# EAGLE design midi-bit-box-v1 (EAGLE 9.6.2)
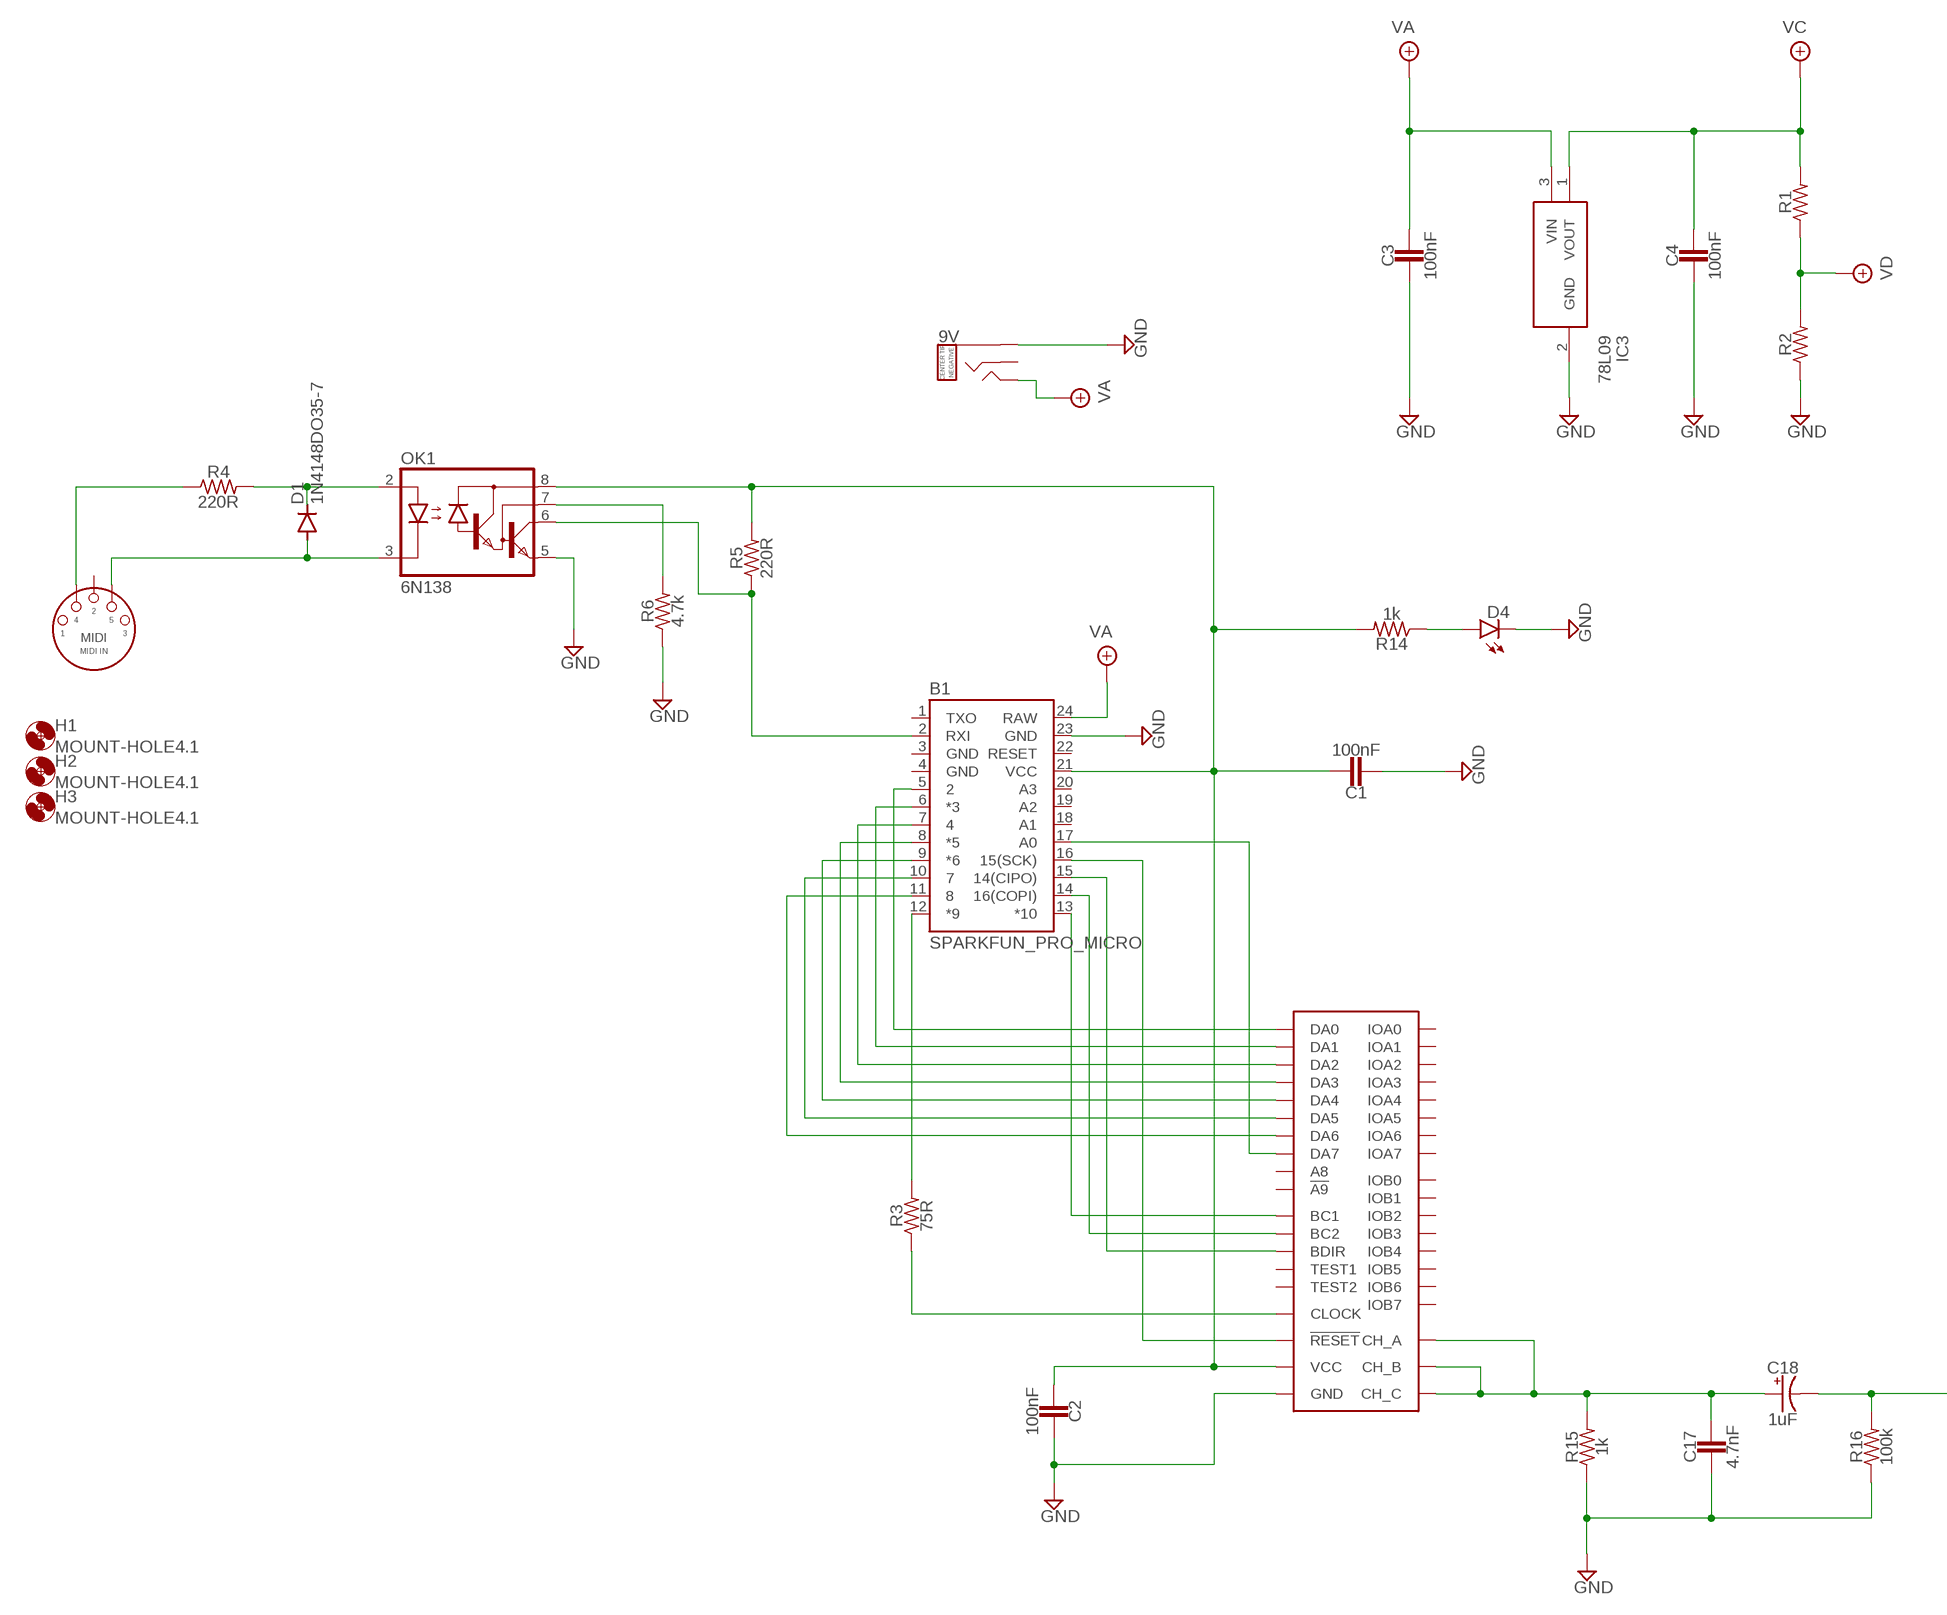
[diagram p0: schematic, sheet 1, part 1 of 2]
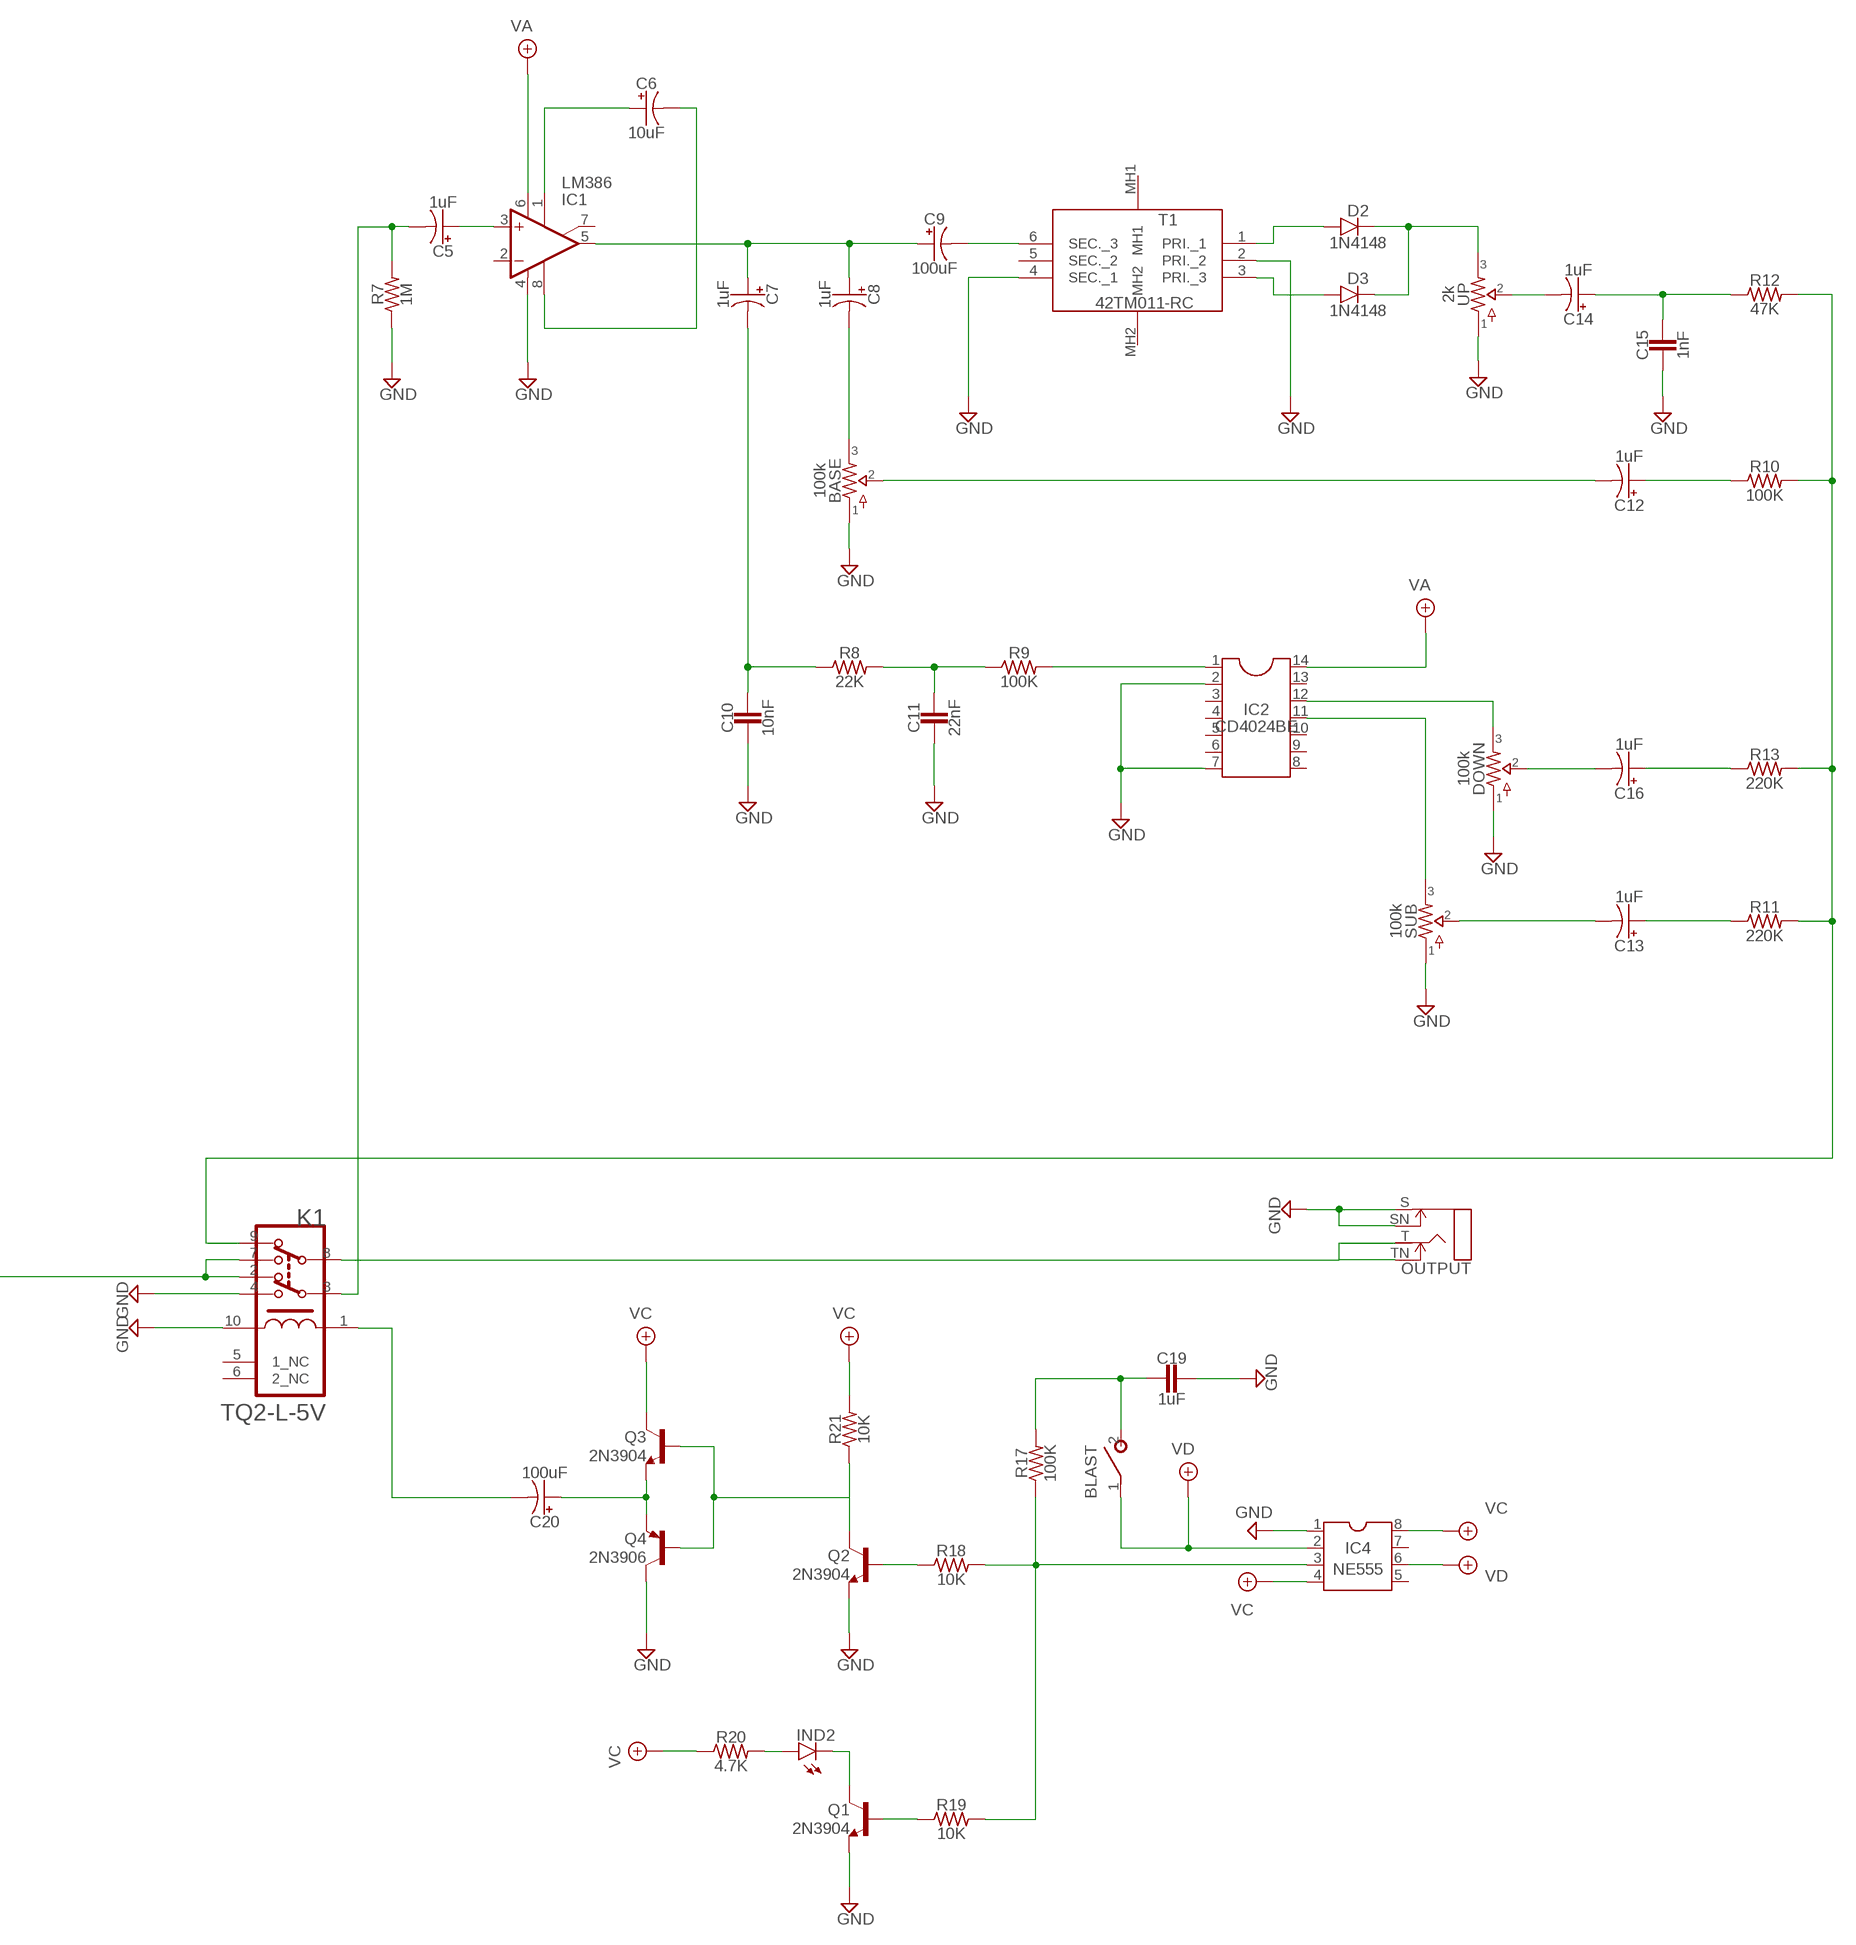
[diagram p1: schematic, sheet 1, part 2 of 2]

## Parts
9V  DC_TRS_PADS  [DC_TRS]
B1  SPARKFUN_PRO_MICRO  [SPARKFUN_PRO_MICRO]
BASE  100k  TRIMMER  [TRIM1]
BLAST  SPST  [SPST.WIRE]
C1  100nF  CAP.2  [0.2".SML]
C2  100nF  CAP.2  [0.2".SML]
C3  100nF  CAP.2  [0.2".SML]
C4  100nF  CAP.2  [0.2".SML]
C5  1uF  5MM.2  [0502]
C6  10uF  5MM.2  [0502]
C7  1uF  5MM.2  [0502]
C8  1uF  5MM.2  [0502]
C9  100uF  5MM.2  [0502]
C10  10nF  CAP.2  [0.2".SML]
C11  22nF  CAP.2  [0.2".SML]
C12  1uF  5MM.2  [0502]
C13  1uF  5MM.2  [0502]
C14  1uF  5MM.2  [0502]
C15  1nF  CAP.2  [0.2".SML]
C16  1uF  5MM.2  [0502]
C17  4.7nF  CAP.2  [0.2".SML]
C18  1uF  5MM.2  [0502]
C19  1uF  CAP.4  [0.2".LRG]
C20  100uF  5MM.2  [0502]
D1  1N4148DO35-7  [DO35-7]
D2  1N4148  DO41.3  [DO41-3]
D3  1N4148  DO41.3  [DO41-3]
D4  LED.2  [3MM_1]
DOWN  100k  TRIMMER  [TRIM1]
H1  MOUNT-HOLE4.1  [4,1]
H2  MOUNT-HOLE4.1  [4,1]
H3  MOUNT-HOLE4.1  [4,1]
IC1  LM386  [DIP08]
IC2  CD4024BE  DIP14  [DIP14.1]
IC3  78L09  L78L09ACZ-TR  [L78L09ACZTR]
IC4  NE555  DIP8_TH  [DIP08]
IND2  5MM_LED  LED.2  [3MM_1]
K1  PANASONIC_TQ2-L-5VPANASONIC_TQ2-L-5V_0_0  [PANASONIC_TQ2-L-5V_0]
MIDI  MIDI IN  MIDI  [3PADS]
OK1  6N138  [DIL08]
OUTPUT  SWITCHED_MONO_PADS  [4PADS]
Q1  2N3904  2N5088  [TO92]
Q2  2N3904  2N5088  [TO92]
Q3  2N3904  2N5088  [TO92]
Q4  2N3906  2N5087  [TO92]
R1  R.3B  [0.3".B]
R2  R.3B  [0.3".B]
R3  75R  R.3B  [0.3".B]
R4  220R  R.3B  [0.3".B]
R5  220R  R.3B  [0.3".B]
R6  4.7k  R.3B  [0.3".B]
R7  1M  R.3B  [0.3".B]
R8  22K  R.3B  [0.3".B]
R9  100K  R.3B  [0.3".B]
R10  100K  R.3B  [0.3".B]
R11  220K  R.3B  [0.3".B]
R12  47K  R.3B  [0.3".B]
R13  220K  R.3B  [0.3".B]
R14  1k  R.3B  [0.3".B]
R15  1k  R.3B  [0.3".B]
R16  100k  R.3B  [0.3".B]
R17  100K  R.3B  [0.3".B]
R18  10K  R.3B  [0.3".B]
R19  10K  R.3B  [0.3".B]
R20  4.7K  R.3B  [0.3".B]
R21  10K  R.3B  [0.3".B]
SUB  100k  TRIMMER  [TRIM1]
T1  42TM011-RC  [42TM011RC]
U1  AY-3-8910  [DIP-40/600MIL]
UP  2k  TRIMMER  [TRIM1]

## Nets
GND: 9V.PWR B1.23(GND) BASE.1 C1.2 C2.1 C3.2 C4.2 C10.2 C11.2 C15.2 C17.2 C19.1 D4.K(C) DOWN.1 IC1.4(V-) IC2.2 IC2.7 IC3.2(GND) IC4.1 K1.4 K1.10(S-/R+) OK1.5(GND) OUTPUT.S OUTPUT.SN Q1.3(E) Q2.3(E) Q4.1(C) R2.1 R6.1 R7.1 R15.1 R16.1 SUB.1 T1.2(PRI._2) T1.4(SEC._1) U1.1(GND) UP.1
N$1: MIDI.T R4.1
N$2: D1.C OK1.2(A) R4.2
N$3: D1.A MIDI.S OK1.3(C)
N$4: B1.21(VCC) C1.1 C2.2 OK1.8(VCC) R5.2 R14.2 U1.40(VCC)
N$5: OK1.7(VB) R6.2
N$6: B1.2(RXI) OK1.6(VO) R5.1
N$7: IC4.3 R17.1 R18.2 R19.2
N$8: K1.8 OUTPUT.T OUTPUT.TN
N$9: B1.12(*9) R3.2
N$10: R3.1 U1.22(CLOCK)
N$11: B1.16(15(SCK)) U1.23(!RESET)
N$12: B1.5 U1.37(DA0)
N$13: B1.6(*3) U1.36(DA1)
N$14: B1.7 U1.35(DA2)
N$15: B1.8(*5) U1.34(DA3)
N$16: B1.9(*6) U1.33(DA4)
N$17: B1.10 U1.32(DA5)
N$18: B1.11 U1.31(DA6)
N$19: B1.17(A0) U1.30(DA7)
N$20: B1.13(*10) U1.29(BC1)
N$21: B1.14(16(COPI)) U1.28(BC2)
N$22: B1.15(14(CIPO)) U1.27(BDIR)
N$23: BASE.2 C12.-
N$24: C16.- DOWN.2
N$25: DOWN.3 IC2.12
N$26: C5.+ IC1.3(+IN)
N$27: C6.+ IC1.1(GAIN1)
N$28: C6.- IC1.8(GAIN2)
N$29: C7.+ C8.+ C9.+ IC1.5(OUT)
N$30: C9.- T1.6(SEC._3)
N$31: D2.A T1.1(PRI._1)
N$32: D3.A T1.3(PRI._3)
N$33: BASE.3 C8.-
N$34: C7.- C10.1 R8.1
N$35: C11.1 R8.2 R9.1
N$36: IC2.11 SUB.3
N$37: C13.- SUB.2
N$38: D4.A R14.1
N$39: C14.- UP.2
N$40: BLAST.2 C19.2 R17.2
N$41: C12.+ R10.1
N$42: C16.+ R13.1
N$43: C13.+ R11.1
N$44: D2.C D3.C UP.3
N$45: C5.- K1.3 R7.2
N$46: C14.+ C15.1 R12.1
N$47: C17.1 C18.+ R15.2 U1.3(CH_B) U1.4(CH_A) U1.38(CH_C)
N$48: IC2.1 R9.2
N$50: IND2.A R20.2
N$51: Q2.1(C) R21.1
N$52: Q2.2(B) R18.1
N$53: Q1.2(B) R19.1
N$54: IND2.K(C) Q1.1(C)
N$55: C20.+ Q3.3(E) Q4.3(E)
N$56: Q3.2(B) Q4.2(B)
N$57: C20.- K1.1(S+/R-)
N$58: C18.- K1.2 K1.7 R16.2
N$59: K1.9 R10.2 R11.2 R12.2 R13.2
VA: 9V.GND B1.24(RAW) C3.1 IC1.6(V+) IC2.14 IC3.3(VIN)
VC: C4.1 IC3.1(VOUT) IC4.4 IC4.8 Q3.1(C) R1.2 R20.1 R21.2
VD: BLAST.1 IC4.2 IC4.6 R1.1 R2.2
Unconnected: 9V.RNG B1.1(TXO) B1.18(A1) B1.19(A2) B1.20(A3) B1.22(RESET) IC1.2(-IN) IC1.7(BYPASS) IC2.3 IC2.4 IC2.5 IC2.6 IC2.8 IC2.9 IC2.10 IC2.13 IC4.5 IC4.7 K1.5(1_NC) K1.6(2_NC) MIDI.R T1.5(SEC._2) T1.MH1 T1.MH2 U1.6(IOB7) U1.7(IOB6) U1.8(IOB5) U1.9(IOB4) U1.10(IOB3) U1.11(IOB2) U1.12(IOB1) U1.13(IOB0) U1.14(IOA7) U1.15(IOA6) U1.16(IOA5) U1.17(IOA4) U1.18(IOA3) U1.19(IOA2) U1.20(IOA1) U1.21(IOA0) U1.24(!A9) U1.25(A8) U1.26(TEST2) U1.39(TEST1)

## Power pins joined to a net without a drawn wire
GND: B1.3(GND) B1.4(GND)

## Library data of the parts
9V = jacks:DC_TRS: Kobiconn Jack and TRS connections for DC power For center-tip negtaive connections (power from sleeve, ground from tip). Kobiconn 163-7620E: http://smallbear-electronics.mybigcommerce.com/plastic-2-1-mm-pc-mount/ Boss Style: http://smallbear-electronics.mybigcommerce.com/2-1-mm-all-plastic-round/
B1 = SparkFun-Boards:SPARKFUN_PRO_MICRO: SparkFun Pro Micro Atmega32U4 compatible footprint. SparkFun Products: 3.3V/8MHz <https://www.sparkfun.com/products/12587> 5V/16MHz <https://www.sparkfun.com/products/12640>
BASE DOWN SUB UP = potentiometers:TRIMMER: Trimpots
BLAST = switches:SPST: SPST Switches
C1-C4 C10 C11 C15 C17 C19 = caps-film:CAP: For Ceramic, Film, MLCC caps
C5-C9 C12-C14 C16 C18 C20 = caps-elec:5MM: 5mm diameter caps Up to 47uF
D1 = diode:1N4148: DIODE high speed (Philips)
D2 D3 = diodes:DO41: 1N400x, 1N5817 Standard and Schottky Rectifiers, DO-41 Package 1N4001: http://smallbear-electronics.mybigcommerce.com/diode-1n4001/ 1N5817: http://www.mouser.com/ProductDetail/Fairchild-Semiconductor/1N5817/?qs=sGAEpiMZZMtQ8nqTKtFS%2fCJFZUIIOyzjWJhH2RQmKoY%3d
D4 IND2 = diodes:LED: LEDs, all sizes 3mm: http://smallbear-electronics.mybigcommerce.com/led-t-1-3mm-diffused-colors/ 5mm: http://smallbear-electronics.mybigcommerce.com/led-t-1-3-4-5mm-diffused/
H1-H3 = holes:MOUNT-HOLE: MOUNTING HOLE with drill center marker
IC1 = integrated circuits:LM386: LM386 LM386: http://smallbear-electronics.mybigcommerce.com/ic-lm386-n3/
IC2 = integrated circuits:DIP14: Generic 14-pin DIP
IC3 = SamacSys_Parts:L78L09ACZ-TR: Standard Regulator Pos 9V 0.1A 3-Pin TO-92 T/R Source: Datasheet <https://www.st.com/resource/en/datasheet/l78l.pdf>; ARROW_PART_NUMBER: L78L09ACZ-TR; ARROW_PRICE-STOCK: https://www.arrow.com/en/products/l78l09acz-tr/stmicroelectronics; DESCRIPTION: Standard Regulator Pos 9V 0.1A 3-Pin TO-92 T/R; HEIGHT: 4.95mm; MANUFACTURER_NAME: STMicroelectronics; MANUFACTURER_PART_NUMBER: L78L09ACZ-TR; MOUSER_PART_NUMBER: 511-L78L09ACZ-TR; MOUSER_PRICE-STOCK: https://www.mouser.co.uk/ProductDetail/STMicroelectronics/L78L09ACZ-TR?qs=22WmWNTp1rrZjfk%2FYtv2vw%3D%3D
IC4 = integrated circuits:DIP8: Generic 8-pin DIP
K1 = Panasonic - TQ2-L-5V:PANASONIC_TQ2-L-5V: Telecom Relay DPDT (2 Form C) Through Hole 1A 5VDC; AMBIENT_TEMPERATURE_RANGE_HIGH: +70°C; AMBIENT_TEMPERATURE_RANGE_LOW: -40°C; AUTOMOTIVE: No; CENTROID_NOT_SPECIFIED: No; COIL_CURRENT: 20mA; COIL_POWER: 100mW; COIL_RESISTANCE: 250Ω; COIL_TYPE: Latching and Single Coil; COIL_VOLTAGE: 5V; CURRENT_RATING: 1A; DATASHEET: https://b2b-api.panasonic.eu/file_stream/pids/fileversion/4514; DEVICE_CLASS_L1: Electromechanical; DEVICE_CLASS_L2: Relays; DEVICE_CLASS_L3: Signal Relays; DIGIKEY_DESCRIPTION: RELAY TELECOM DPDT 1A 5VDC; DIGIKEY_PART_NUMBER: 255-1004-5-ND; FOOTPRINT_VARIANT_NAME_0: Recommended_Land_Pattern; HEIGHT: 5.4mm; LEAD_FREE: Yes; MF: Panasonic; MFG_PACKAGE_IDENT: 0; MFG_PACKAGE_IDENT_DATE: 0; MFG_PACKAGE_IDENT_REV: 0; MOUSER_DESCRIPTION: Electromechanical Relay 5VDC 250Ohm 1A DPDT (14x9x5)mm THT General Purpose Relay; MOUSER_PART_NUMBER: 769-TQ2-L-5V; MPN: TQ2-L-5V; NUMBER_OF_CONTACTS: 2; PACKAGE: PTH_RELAY_14MM0_9MM0; PREFIX: K; ROHS: Yes; STANDOFF_HEIGHT: 0.25mm; SWITCHING_CURRENT: 1A; SWITCHING_POWER: 30W; TEMPERATURE_RANGE_HIGH: +70°C; TEMPERATURE_RANGE_LOW: -40°C; THROW_CONFIGURATION: DPDT; VERIFICATION_VERSION: 0.0.0.3
MIDI = jacks:MIDI: MIDI Jack Switchcraft 57GB5FX: http://www.mouser.com/ProductDetail/Switchcraft/57GB5FX/?qs=%2fha2pyFadujUo7YG3MjMPfNHnb16z0gNDFv5bGzw1d%252b9onPnvFrm7g%3d%3d
OK1 = optocoupler:6N138: MOTOROLA OPTO COUPLER; MF: VISHAY/TELEFUNKEN; MPN: 6N138; OC_FARNELL: 9860150; OC_NEWARK: 35K5294
OUTPUT = jacks:SWITCHED_MONO: Mono TS Jack and wiring connections for switched applications 1/4" Marshall style (PCB Mount): http://smallbear-electronics.mybigcommerce.com/1-4-enclosed-nmj4hcd2/ 1/8" Jack (wired): http://smallbear-electronics.mybigcommerce.com/1-8-mono-pc-mount/
Q1-Q3 = transistors-BJT:2N5088: NPN - 2n5088, 2n5089, 2n3904, MPSA18 [C]-B-E pinout 2n5088: http://smallbear-electronics.mybigcommerce.com/transistor-2n5088/ 2n5089: http://smallbear-electronics.mybigcommerce.com/transistor-2n5089/ 2n5089: http://smallbear-electronics.mybigcommerce.com/transistor-2n5089-motorola/ 2n3904: http://smallbear-electronics.mybigcommerce.com/transistor-2n3904/ MPSA18: http://smallbear-electronics.mybigcommerce.com/transistor-mpsa18/
Q4 = transistors-BJT:2N5087: PNP - 2n5087, 2n3906 [C]-B-E pinout 2n5087: http://smallbear-electronics.mybigcommerce.com/transistor-2n5087/ 2n3906: http://smallbear-electronics.mybigcommerce.com/transistor-2n3906/
R1-R21 = resistors:R: 1/8W, 1/4W and 1W resistors
T1 = SamacSys_Parts:42TM011-RC: Audio Transformers / Signal Transformers XFMR ST 1.5KCT-500CT Source: Datasheet <https://www.mouser.co.uk/datasheet/2/449/XC-600134-1212477.pdf>; DESCRIPTION: Audio Transformers / Signal Transformers XFMR ST 1.5KCT-500CT; HEIGHT: 16.9926mm; MANUFACTURER_NAME: Xicon; MANUFACTURER_PART_NUMBER: 42TM011-RC; MOUSER_PART_NUMBER: 42TM011-RC; MOUSER_PRICE-STOCK: https://www.mouser.co.uk/ProductDetail/Xicon/42TM011-RC?qs=h3Xc2LqAealMFTkJCAd4Kw%3D%3D
U1 = AY-3-8910:AY-3-8910: Check prices <https://pricing.snapeda.com/parts/AY-3-8910/General%20Instrument/view-part?ref=eda>; AVAILABILITY: Not in stock; MF: General Instrument; MP: AY-3-8910; PACKAGE: None; PRICE: None

## Board
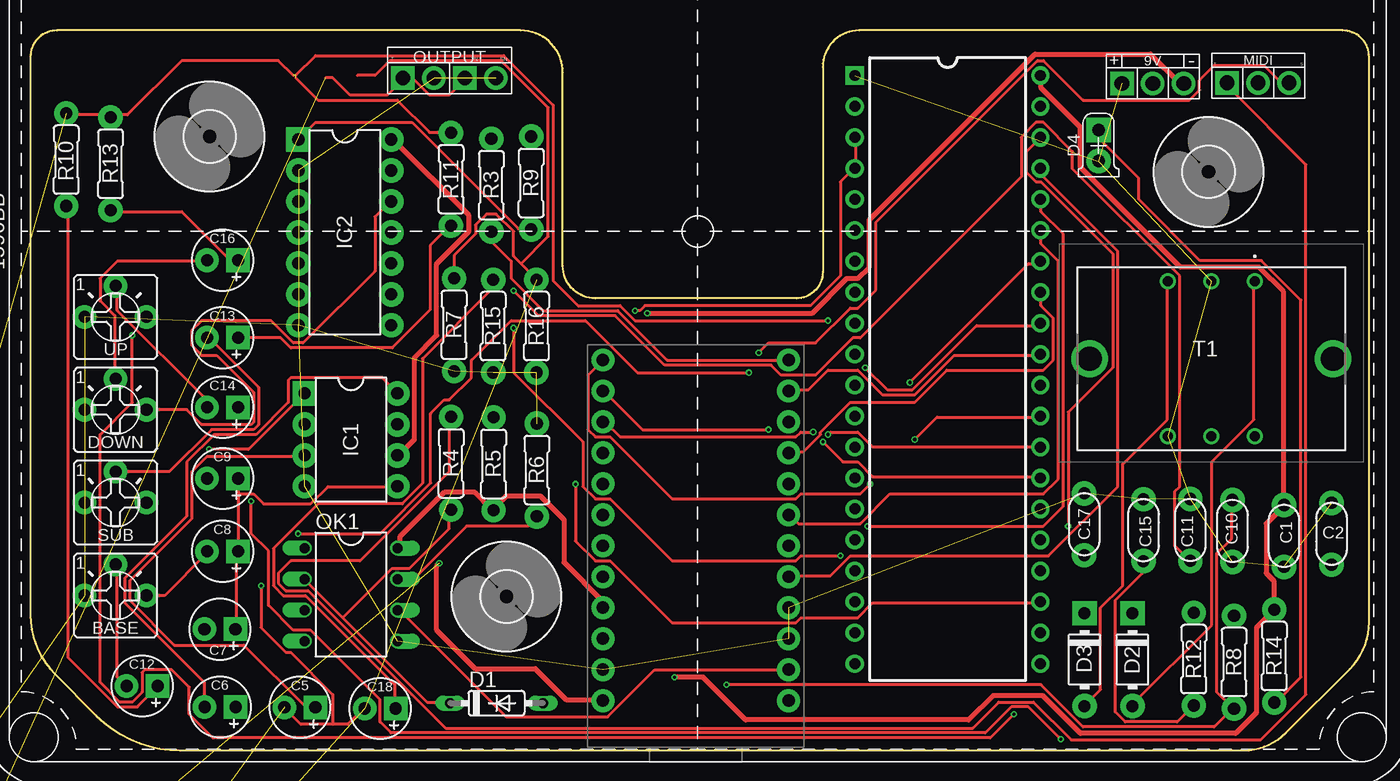
[diagram p2: board, top side]
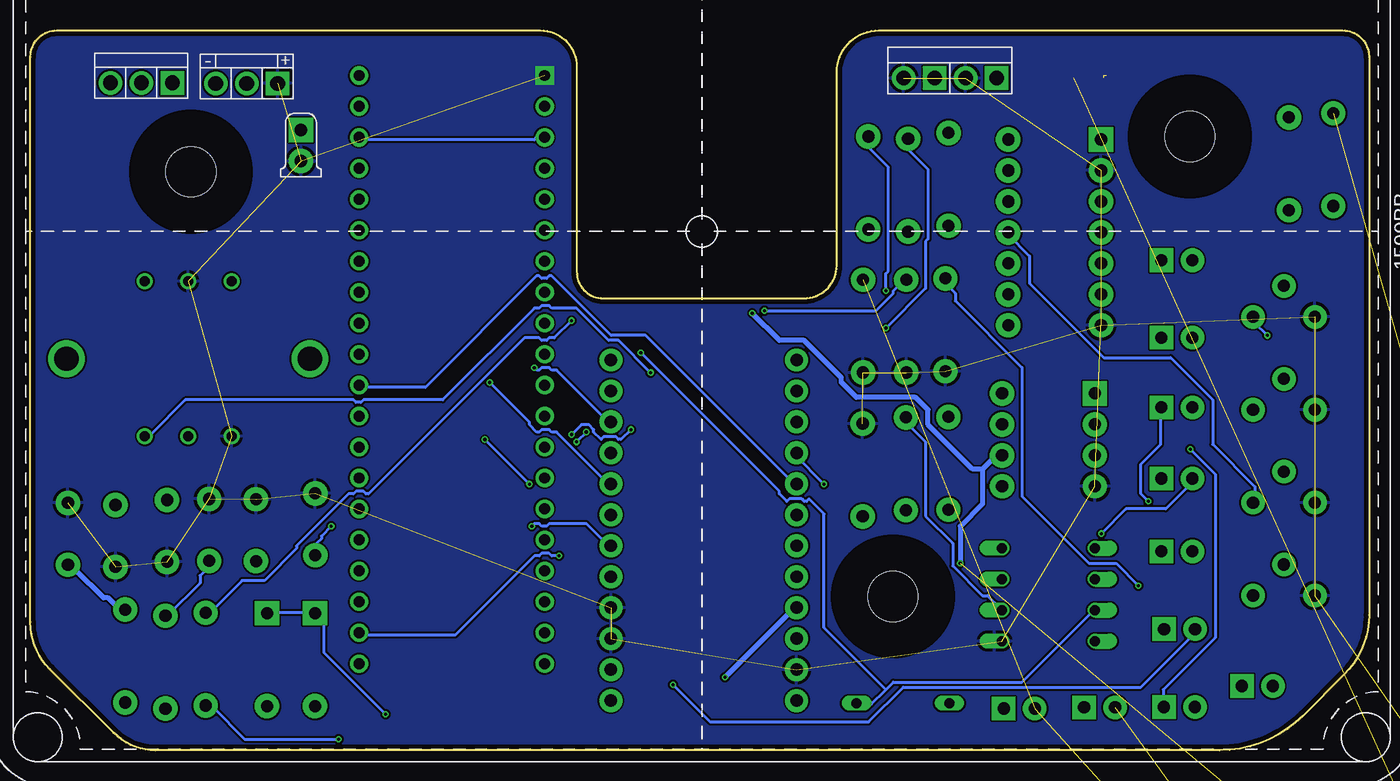
[diagram p3: board, bottom side, seen from below]

Size 109.86 x 59.05 mm. Coordinates in mm from the lower left corner, seen from the top.
Outline: 43.69,39.75 43.69,55.6 arc90 40.23,59.05 2.17,59.05 arc90 0,56.89 0,11.1 arc45 2.01,6.24 5.41,2.85 arc45 12.28,0 99.59,0 arc45 103.02,1.42 108.26,6.66 arc45 109.86,10.51 109.86,56.89 arc90 107.69,59.05 68.01,59.05 arc90 65.02,56.07 65.02,39.24 arc-90 62.86,37.08 46.35,37.08 arc-90 43.69,39.75
Copper layers (1*16): Top 0.035559375mm / dielectric 1.6mm / Bottom 0.035559375mm
Design rules "oshpark-2layer *": minimum track width 10mil, minimum drill 10mil, track to track 6mil, track to pad 6mil, pad to pad 6mil, via to via 6mil, smd to smd 6mil, copper to edge 15mil, drill to drill 6mil, minimum pad ring 5mil, minimum via ring 5mil, stop-mask expansion 2.5mil, vias tented up to drill 0mil, thermal gap 10mil

### Footprints (pad centres in the part's own frame; a part is rotated, then mirrored left to right if it is on the bottom)
DC_TRS = drill 1.2 pad 1.93: GND 2.54,0; RNG 0,0 | drill 1.2 pad 1.93 square: PWR -2.54,0
SPARKFUN_PRO_MICRO = drill 1.016 pad 1.88: 1 -7.62,12.7; 2 -7.62,10.16; 3 -7.62,7.62; 4 -7.62,5.08; 5 -7.62,2.54; 6 -7.62,0; 7 -7.62,-2.54; 8 -7.62,-5.08; 9 -7.62,-7.62; 10 -7.62,-10.16; 11 -7.62,-12.7; 12 -7.62,-15.24; 13 7.62,-15.24; 14 7.62,-12.7; 15 7.62,-10.16; 16 7.62,-7.62; 17 7.62,-5.08; 18 7.62,-2.54; 19 7.62,0; 20 7.62,2.54; 21 7.62,5.08; 22 7.62,7.62; 23 7.62,10.16; 24 7.62,12.7
TRIM1 = drill 1 pad 1.93: 1 -2.54,0; 2 0,2.54; 3 2.54,0
SPST.WIRE = drill 1.2 pad 2.032 square: 1 -1.27,0 | drill 1.2 pad 2.032: 2 1.27,0
0.2".SML = drill 1 pad 2: 1 -2.54,0; 2 2.54,0
0502 = drill 1 pad 1.93 square: + -1.27,0 | drill 1 pad 1.93: - 1.27,0
0.2".LRG = drill 1 pad 2: 1 -2.54,0; 2 2.54,0
DO35-7 = drill 0.813 long: A 3.81,0; C -3.81,0
DO41-3 = drill 1 pad 2: A 3.81,0 | drill 1 pad 2 square: C -3.81,0
3MM_1 = drill 1 pad 2 square: A -1.27,0 | drill 1 pad 2: K 1.27,0
4,1 = hole 4.1: 0,0
DIP08 = drill 1 pad 2 square: 1 -3.81,-3.81 | drill 1 pad 2: 2 -1.27,-3.81; 3 1.27,-3.81; 4 3.81,-3.81; 5 3.81,3.81; 6 1.27,3.81; 7 -1.27,3.81; 8 -3.81,3.81
DIP14.1 = drill 1 pad 2 square: 1 -7.62,-3.81 | drill 1 pad 2: 2 -5.08,-3.81; 3 -2.54,-3.81; 4 0,-3.81; 5 2.54,-3.81; 6 5.08,-3.81; 7 7.62,-3.81; 8 7.62,3.81; 9 5.08,3.81; 10 2.54,3.81; 11 0,3.81; 12 -2.54,3.81; 13 -5.08,3.81; 14 -7.62,3.81
L78L09ACZTR = drill 0.85 pad 1.381: 1 0,0; 2 1.27,1.27; 3 2.54,0
PANASONIC_TQ2-L-5V_0 = drill 1 pad 1.55 square: 1 -5.08,-3.81 | drill 1 pad 1.55: 2 -2.54,-3.81; 3 0,-3.81; 4 2.54,-3.81; 5 5.08,-3.81; 6 5.08,3.81; 7 2.54,3.81; 8 0,3.81; 9 -2.54,3.81; 10 -5.08,3.81
3PADS = drill 1.2 pad 1.93: R 0,0; S 2.54,0 | drill 1.2 pad 1.93 square: T -2.54,0
DIL08 = drill 0.813 offset: 1 -3.81,-3.81; 2 -1.27,-3.81; 3 1.27,-3.81; 4 3.81,-3.81; 5 3.81,3.81; 6 1.27,3.81; 7 -1.27,3.81; 8 -3.81,3.81
4PADS = drill 1.2 pad 1.93: S 0,0; SN 5.08,0 | drill 1.2 pad 1.93 square: T -2.54,0; TN 2.54,0
TO92 = drill 1 pad 1.93 square: 1 -2.54,0 | drill 1 pad 1.93: 2 0,0; 3 2.54,0
0.3".B = drill 1 pad 2: 1 -3.81,0; 2 3.81,0
42TM011RC = drill 0.81 pad 1.316: 1 0,0; 2 3.556,0; 3 7.112,0; 4 7.112,12.7; 5 3.556,12.7; 6 0,12.7 | drill 2.003 pad 3.005: MH1 -6.426,6.35; MH2 13.538,6.35
DIP-40/600MIL = drill 0.9 pad 1.5 square: 1 -7.62,24.13 | drill 0.9 pad 1.5: 2 -7.62,21.59; 3 -7.62,19.05; 4 -7.62,16.51; 5 -7.62,13.97; 6 -7.62,11.43; 7 -7.62,8.89; 8 -7.62,6.35; 9 -7.62,3.81; 10 -7.62,1.27; 11 -7.62,-1.27; 12 -7.62,-3.81; 13 -7.62,-6.35; 14 -7.62,-8.89; 15 -7.62,-11.43; 16 -7.62,-13.97; 17 -7.62,-16.51; 18 -7.62,-19.05; 19 -7.62,-21.59; 20 -7.62,-24.13; 21 7.62,-24.13; 22 7.62,-21.59; 23 7.62,-19.05; 24 7.62,-16.51; 25 7.62,-13.97; 26 7.62,-11.43; 27 7.62,-8.89; 28 7.62,-6.35; 29 7.62,-3.81; 30 7.62,-1.27; 31 7.62,1.27; 32 7.62,3.81; 33 7.62,6.35; 34 7.62,8.89; 35 7.62,11.43; 36 7.62,13.97; 37 7.62,16.51; 38 7.62,19.05; 39 7.62,21.59; 40 7.62,24.13

### Placement (x,y rotation side)
9V  92.11,54.71 0 top
B1  54.6,16.78 180 top
BASE  6.98,12.7 0 top
BLAST  -28.83,-73.15 0 top  (outside the outline)
C1  102.88,17.59 270 top
C2  106.78,17.76 270 top
C3  -27.81,-38.61 0 top  (outside the outline)
C4  -27.81,-41.66 0 top  (outside the outline)
C5  22.12,3.52 180 top
C6  15.56,3.56 180 top
C7  15.55,9.94 180 top
C8  15.77,16.33 180 top
C9  15.77,22.3 180 top
C10  98.64,18 270 top
C11  95.19,18.08 90 top
C12  9.16,5.28 180 top
C13  15.77,33.85 180 top
C14  15.77,28.14 180 top
C15  91.34,18.06 90 top
C16  15.77,40.2 180 top
C17  86.49,18.54 90 top
C18  28.7,3.43 180 top
C19  -27.81,-77.22 0 top  (outside the outline)
C20  -28.83,-118.36 0 top  (outside the outline)
D1  38.25,3.87 0 top
D2  90.44,7.44 270 top
D3  86.5,7.44 270 top
D4  87.66,49.61 270 bottom
DOWN  6.98,27.94 0 top
H1  39.07,12.61 0 top
H2  96.69,47.46 0 top
H3  14.7,50.35 0 top
IC1  26.31,25.47 270 top
IC2  25.8,42.49 270 top
IC3  -28.83,-34.54 0 top  (outside the outline)
IC4  -26.29,-65.02 0 top  (outside the outline)
IND2  -28.83,-99.57 0 top  (outside the outline)
K1  -23.75,-54.36 0 top  (outside the outline)
MIDI  100.76,54.76 0 top
OK1  26.31,12.77 270 top
OUTPUT  33.12,55.15 0 top
Q1  -27.81,-89.41 0 top  (outside the outline)
Q2  -27.81,-93.98 0 top  (outside the outline)
Q3  -27.81,-108.2 0 top  (outside the outline)
Q4  -27.81,-112.78 0 top  (outside the outline)
R1  -26.8,-44.2 0 top  (outside the outline)
R2  -26.8,-46.74 0 top  (outside the outline)
R3  37.82,46.36 270 top
R4  34.52,23.54 270 top
R5  38,23.51 270 top
R6  41.56,23 270 top
R7  34.77,34.91 90 top
R8  98.78,7.23 90 top
R9  41.09,46.54 270 top
R10  2.94,48.46 90 top
R11  34.51,46.85 90 top
R12  95.47,7.48 90 top
R13  6.57,48.12 90 top
R14  102.08,7.73 90 top
R15  37.97,34.8 90 top
R16  41.53,34.8 90 top
R17  -26.8,-81.28 0 top  (outside the outline)
R18  -26.8,-83.82 0 top  (outside the outline)
R19  -26.8,-86.36 0 top  (outside the outline)
R20  -26.8,-102.62 0 top  (outside the outline)
R21  -26.8,-105.16 0 top  (outside the outline)
SUB  6.98,20.32 0 top
T1  100.47,38.47 180 top
U1  75.27,31.23 0 top
U$1  [1590BB]  54.76,42.57 270 top
UP  6.98,35.56 0 top

### Tracks (layer width: path | path; a pad name or v marks a point on that pad's centre or on a via)
GND  (38 unrouted)
  pour Bottom: -5.44,90.2 114.45,90.2 114.45,-3.75 -5.44,-3.75
N$1
  Top 0.254: MIDI.T 98.37,54.56 98.37,54.36 104.67,48.06 104.67,4.57 100.97,0.86 85.42,0.86 82.32,3.96 79.48,3.96 77.34,1.83 34.06,1.83 22.78,13.11 20.96,13.11 20.35,13.72 20.35,14.53 21.36,15.55 27.05,15.55 34.37,22.86 34.37,27.33 R4.1
N$2
  Top 0.254: 25.63,10.87 22.58,13.92 OK1.2 | 25.63,10.87 32.54,3.96 34.37,3.96 D1.C | 25.63,10.87 29.69,14.93 31.12,14.93 34.37,18.19 34.37,19.61 R4.2
N$3  (via drill 0.25)
  Top 0.254: v59.77,32.61 60.58,33.43 64.44,33.43 67.29,36.27 67.89,36.27 69.37,37.74 69.37,43.31 82.65,56.59 83.13,56.59 86.39,53.34 95.12,53.34 95.94,54.15 95.94,54.97 97.16,56.19 101.22,56.19 102.64,54.76 103.25,54.76 MIDI.S
  Bottom 0.254: 39.65,4.98 40.87,3.76 41.88,3.76 D1.A | 39.65,4.98 39.04,5.59 28.47,5.59 22.58,11.48 OK1.3 | v59.77,32.61 48.39,21.23 48.39,21.03 47.78,20.42 47.57,20.62 46.56,20.62 46.35,20.42 46.15,20.42 45.95,20.62 44.73,19.41 44.73,10.06 39.65,4.98
N$4  (via drill 0.25)
  Top 0.406: OK1.8 30.3,16.76 30.3,17.5 33.96,21.16 36.47,21.16 37.82,19.81 R5.2 38.02,19.81 39.09,20.88 41.83,20.88 43.79,18.92 43.79,15.42 46.96,12.24 46.96,11.89 B1.21 | U1.40 82.93,55.17 82.93,54.36 86.18,51.1 86.18,47.85 94.39,39.65 100.81,39.65 102.84,37.62 102.84,20.22 C1.1 102.84,20.02 101.42,18.59 101.42,14.53 102.03,13.92 102.03,11.68 R14.2 102.03,11.48 100.61,10.06 100.61,3.1 98.91,1.4 86.18,1.4 83.08,4.5 79.02,4.5 77.01,2.49 58.7,2.49 55.19,5.99 v52.86,5.99
  Bottom 0.406: C2.2 106.7,15.14 106.3,14.73 106.1,14.73 103.86,12.5 103.45,12.5 102.64,11.68 102.23,11.68 R14.2 | v52.86,5.99 47.17,11.68 B1.21
N$5
  Top 0.254: OK1.7 30.3,14.12 31.52,14.12 35.79,18.39 40.87,18.39 41.48,19 R6.2
N$6
  Top 0.254: B1.2 62.2,6.6 51.23,6.6 47.37,2.74 39.04,2.74 30.3,11.48 OK1.6
  Bottom 0.254: OK1.6 30.3,11.68 31.32,12.7 31.73,12.7 34.16,15.14 34.16,16.97 36.4,19.2 36.4,25.3 37.82,26.72 37.82,27.13 R5.1
N$7  (3 unrouted)
N$8  (1 unrouted)
  Top 0.254: OUTPUT.TN 35.59,54.97 34.37,53.75 32.74,53.75 31.52,54.97 30.71,54.97 OUTPUT.T 30.51,54.97 29.29,53.75 26.24,53.75 24.82,55.17 24.21,55.17
N$9
  Top 0.254: B1.12 62.2,32 52.25,32 48.18,36.07 42.09,36.07 39.45,38.71 39.45,40.13 38.02,41.55 38.02,42.37 R3.2
N$10  (via drill 0.25)
  Top 0.254: v66.47,15.95 63.22,15.95 62.81,15.55 52.65,15.55 47.57,20.62 46.35,20.62 45.34,21.64 45.34,25.3 39.65,30.99 v39.65,34.65
  Bottom 0.254: v66.47,15.95 67.08,15.95 67.29,16.15 67.89,16.15 68.1,15.95 68.5,15.95 75.01,9.45 82.73,9.45 U1.22 | v39.65,34.65 36.4,37.9 36.4,41.76 36.2,41.96 36.2,47.65 37.82,49.28 37.82,50.09 R3.1
N$11  (via drill 0.25)
  Top 0.254: v44.73,21.84 44.73,17.17 46.35,15.55 47.57,15.55 52.65,10.46 62.81,10.46 63.22,10.87 67.89,10.87 69.11,12.09 82.73,12.09 U1.23
  Bottom 0.254: v44.73,21.84 47.17,24.28 B1.16
N$12
  Top 0.254: U1.37 82.93,47.65 82.93,47.24 89.23,40.95 89.23,21.64 83.54,15.95 67.29,15.95 65.66,14.33 62.41,14.33 B1.5
N$13  (via drill 0.25)
  Top 0.254: v68.71,18.39 83.13,18.39 84.76,20.02 84.76,42.37 82.93,44.2 82.93,45.01 U1.36
  Bottom 0.254: v68.71,18.39 68.5,18.59 68.1,18.59 67.89,18.39 67.49,18.39 67.29,18.59 64.24,18.59 62.41,16.76 B1.6
N$14
  Top 0.254: U1.35 82.93,42.57 82.93,41.55 84.35,40.13 84.35,22.25 83.13,21.03 70.54,21.03 68.1,18.59 63.02,18.59 62.41,19.2 B1.7
N$15  (via drill 0.25)
  Top 0.254: v72.16,30.18 81.92,39.93 82.73,39.93 U1.34
  Bottom 0.254: v72.16,30.18 68.91,26.92 68.91,26.72 68.3,26.11 68.1,26.11 67.89,26.31 67.29,26.31 67.08,26.11 66.68,26.11 62.41,21.84 B1.8
N$16
  Top 0.254: U1.33 82.93,37.49 82.93,36.47 83.95,35.46 83.95,32 83.13,31.19 75.21,31.19 72.57,28.55 67.29,28.55 64.85,26.11 64.85,25.91 63.42,24.49 62.41,24.49 B1.9
N$17  (via drill 0.25)
  Top 0.254: v68.5,31.39 70.33,29.57 72.37,29.57 77.65,34.85 82.73,34.85 U1.32
  Bottom 0.254: v68.5,31.39 68.3,31.19 68.1,31.19 67.89,31.39 67.29,31.39 67.08,31.19 66.68,31.19 62.41,26.92 B1.10
N$18
  Top 0.254: U1.31 82.73,32.41 75.82,32.41 72.57,29.16 69.93,29.16 67.89,31.19 65.46,31.19 63.83,29.57 62.41,29.57 B1.11
N$19
  Bottom 0.254: U1.30 82.73,29.77 77.45,29.77 68.3,38.91 68.1,38.91 67.89,38.71 67.49,38.71 67.29,38.91 67.08,38.91 62.2,34.04 59.36,34.04 47.17,21.84 B1.17
N$20  (via drill 0.25)
  Top 0.254: v72.57,25.5 74.4,27.33 82.73,27.33 U1.29 | v68.91,21.84 68.1,21.03 63.22,21.03 62.81,20.62 52.65,20.62 47.57,25.7 46.35,25.7 45.74,26.31 45.74,30.79 46.96,32 B1.13
  Bottom 0.254: v68.91,21.84 v72.57,25.5
N$21  (via drill 0.25)
  Top 0.254: v65.46,25.91 65.66,26.11 67.89,26.11 69.11,24.89 82.73,24.89 U1.28 | v60.58,26.31 50.22,26.31 47.17,29.36 B1.14
  Bottom 0.254: v65.46,25.91 64.64,26.72 64.03,26.72 63.63,26.31 63.63,26.11 63.02,25.5 62.81,25.7 61.8,25.7 61.59,25.5 61.39,25.5 v60.58,26.31
N$22  (via drill 0.25)
  Top 0.254: v65.05,25.3 66.68,23.67 67.89,23.67 69.11,22.45 82.73,22.45 U1.27 | v64.24,26.11 63.22,26.11 62.81,25.7 48.39,25.7 47.17,26.92 B1.15
  Bottom 0.254: v64.24,26.11 v65.05,25.3
N$23
  Top 0.254: BASE.2 7.14,15.14 7.14,5.99 7.75,5.38 C12.-
N$24
  Top 0.254: DOWN.2 6.93,30.58 6.93,35.66 5.71,36.88 5.71,38.71 7.14,40.13 14.45,40.13 C16.-
N$25
  Top 0.254: DOWN.3 12.83,27.94 14.05,26.72 18.11,26.72 18.31,26.92 18.31,29.36 15.27,32.41 14.05,32.41 13.23,33.22 13.23,34.44 14.05,35.26 19.74,35.26 21.57,33.43 22.38,33.43 28.27,39.32 28.27,43.79 29.49,45.01 IC2.12
N$26
  Top 0.254: C5.+ 23.19,3.56 22.58,3.56 17.5,8.64 11.81,8.64 8.15,12.29 8.15,13.92 13.23,19 13.23,22.86 14.45,24.08 22.38,24.08 IC1.3
N$27  (via drill 0.25)
  Top 0.254: v14.66,24.69 17.91,24.69 22.38,29.16 IC1.1
  Bottom 0.254: v14.66,24.69 12.62,22.66 12.62,9.25 16.89,4.98 16.89,3.56 C6.+
N$28
  Top 0.254: C6.- 14.25,3.56 14.25,5.59 7.75,12.09 7.75,14.12 12.83,19.2 12.83,23.67 15.06,25.91 18.52,25.91 21.16,28.55 21.16,30.38 21.36,30.58 28.88,30.58 30.1,29.36 IC1.8
N$29
  Top 0.254: C7.+ 16.89,10.06 16.89,16.15 C8.+ 17.09,16.36 17.09,21.03 | 17.09,21.03 17.09,22.25 C9.+ | 17.09,21.03 18.31,21.03 19.13,20.22 22.99,20.22 24.41,21.64 30.1,21.64 IC1.5
N$30  (via drill 0.25)
  Top 0.254: v58.95,30.99 49.81,30.99 45.54,35.26 39.45,35.26 36.2,32 36.2,30.58 34.37,28.75 33.96,28.75 32.84,27.63 32.84,21.95 28.68,17.78 v21.97,17.78
  Bottom 0.254: v58.95,30.99 61.59,33.63 62.41,33.63 65.05,36.27 67.08,36.27 67.29,36.47 67.89,36.47 68.1,36.27 68.5,36.27 76.02,28.75 82.53,28.75 82.73,28.55 83.13,28.55 83.34,28.75 97.16,28.75 100,25.91 100.41,25.91 T1.6 | v21.97,17.78 19.94,19.81 16.69,19.81 14.66,21.84 14.66,22.25 C9.-
N$31
  Top 0.254: T1.1 100.41,38.3 100.41,27.13 96.95,23.67 96.95,10.26 90.45,3.76 D2.A
N$32
  Top 0.254: T1.3 93.29,38.3 93.29,27.13 89.64,23.47 89.64,13.51 87.81,11.68 87.81,4.98 86.59,3.76 D3.A
N$33
  Top 0.254: BASE.3 11,12.7 14.45,16.15 C8.-
N$34  (via drill 0.25)
  Top 0.254: v57.12,5.38 82.93,5.38 86.39,1.93 97.16,1.93 98.58,3.35 R8.1 98.58,3.56 97.36,4.78 97.36,16.15 98.58,17.37 98.58,20.42 C10.1
  Bottom 0.254: v57.12,5.38 54.08,2.34 41.07,2.34 38.23,5.18 18.72,5.18 14.45,9.45 14.45,9.86 C7.-
N$35  (via drill 0.25)
  Top 0.254: v39.65,37.69 41.68,35.66 47.98,35.66 52.04,31.6 60.78,31.6 61.59,30.79 64.44,30.79 67.49,33.83 68.1,33.83 81.31,47.04 81.31,50.29 82.53,51.51 83.13,51.51 85.52,49.12 85.52,47.7 94.31,38.91 94.31,21.64 93.9,21.23 93.9,16.76 95.12,15.55 C11.1
  Bottom 0.254: v39.65,37.69 39.65,39.12 39.45,39.32 39.45,47.85 41.07,49.48 41.07,50.29 R9.1 | R8.2 98.58,11.07 95.94,13.72 95.94,14.33 95.33,14.93 95.33,15.34 C11.1
N$36
  Bottom 0.254: SUB.3 9.37,20.42 9.37,21.64 12.83,25.09 12.83,28.75 16.28,32.21 21.77,32.21 27.86,38.3 27.86,40.54 29.69,42.37 IC2.11
N$37
  Top 0.254: SUB.2 11.4,22.86 14.86,26.31 18.31,26.31 18.72,26.72 18.72,29.77 14.66,33.83 C13.-
N$38
  Top 0.254: D4.A 87.81,50.7 87.81,50.09 90.96,46.94 90.96,45.21 95.99,40.18 101.02,40.18 104.27,36.93 104.27,5.99 102.23,3.96 R14.1
N$39
  Top 0.254: UP.2 7.14,38.1 7.14,36.07 14.45,28.75 14.45,28.14 C14.-
N$40  (2 unrouted)
N$41
  Top 0.254: C12.+ 10.39,5.18 8.76,3.56 7.14,3.56 3.07,7.62 3.07,44.6 R10.1
N$42
  Top 0.254: C16.+ 16.89,40.34 16.28,40.34 12.42,44.2 6.73,44.2 R13.1
N$43
  Top 0.254: C13.+ 17.09,33.83 20.55,33.83 21.36,33.02 29.69,33.02 32.82,36.14 32.82,41.43 34.37,42.98 R11.1
N$44  (via drill 0.25)
  Top 0.254: v8.36,34.04 8.36,28.55 5.71,25.91 5.71,5.59 7.34,3.96 8.36,3.96 9.17,4.78 9.17,6.4 9.37,6.6 11.61,6.6 13.03,5.18 13.03,2.95 14.96,1.02 78.77,1.02 v80.7,2.95
  Bottom 0.254: v8.36,34.04 9.37,35.05 9.37,35.46 UP.3 | v80.7,2.95 85.78,8.03 85.78,10.46 86.39,11.07 D3.C 86.59,11.28 90.25,11.28 D2.C
N$45  (via drill 0.25)  (1 unrouted)
  Top 0.254: 24.82,2.13 26.04,2.13 27.25,3.35 | 24.82,2.13 22.17,2.13 20.96,3.35 C5.- | 41.48,38.71 40.26,39.93 | 40.26,39.93 39.65,40.54 39.65,42.57 38.23,43.99 37.41,43.99 36.52,43.1 36.52,42.37 34.77,40.62 34.77,38.91 R7.2 | 26.85,55.37 28.27,55.37 29.49,56.59 38.63,56.59 42.49,52.73 42.49,42.16 40.26,39.93 | 24.82,2.13 24.82,4.57 21.36,8.03 20.96,8.03 18.92,10.06 v18.92,13.51
  Bottom 0.254: v18.92,13.51 20.75,15.34 22.99,15.34 28.47,20.83 28.47,31.39 33.96,36.88 33.96,37.49 34.57,38.1 34.57,38.71 R7.2
N$46  (via drill 0.25)
  Top 0.254: v18.11,20.42 18.11,17.78 19.53,16.36 19.53,11.89 21.57,9.86 22.99,9.86 28.68,4.17 28.68,2.34 29.59,1.42 78.36,1.42 80.49,3.56 81.92,3.56 v84.56,0.91 | C15.1 91.26,15.34 91.26,14.53 89.03,12.29 89.03,3.15 89.84,2.34 94.11,2.34 95.33,3.56 R12.1
  Bottom 0.254: v18.11,20.42 18.72,21.03 18.72,23.47 17.09,25.09 17.09,27.94 C14.+ | v84.56,0.91 92.28,0.91 94.92,3.56 95.33,3.56 R12.1
N$47  (via drill 0.25)
  Top 0.254: C18.+ 29.9,3.56 29.9,5.38 22.58,12.7 20.75,12.7 19.94,13.51 19.94,16.56 23.6,20.22 30.51,20.22 32.18,21.89 32.18,32.13 37.82,37.77 37.82,38.51 R15.2 | U1.3 67.69,50.09 67.69,47.85 U1.4 67.49,47.65 66.47,46.63 66.47,38.91 64.03,36.47 50.42,36.47 50.01,36.07 v49.61,36.07 | v85.17,18.39 85.17,27.74 88.82,31.39 88.82,40.74 82.93,46.63 82.53,46.63 81.71,47.45 81.71,49.07 82.73,50.09 U1.38
  Bottom 0.254: U1.38 82.73,50.09 68.5,50.09 68.3,50.29 67.69,50.29 U1.3 | v85.17,18.39 85.98,17.58 85.98,17.37 86.39,16.97 86.39,16.15 C17.1 | v49.61,36.07 40.46,36.07 39.04,37.49 39.04,37.69 38.63,38.1 38.43,38.1 38.02,38.51 R15.2
N$48
  Top 0.254: R9.2 41.07,42.77 40.06,42.77 31.32,51.51 23.39,51.51 22.17,50.29 IC2.1
N$50  (1 unrouted)
N$51  (1 unrouted)
N$52  (1 unrouted)
N$53  (1 unrouted)
N$54  (1 unrouted)
N$55  (2 unrouted)
N$56  (1 unrouted)
N$57  (1 unrouted)
N$58  (3 unrouted)
N$59  (via drill 0.25)  (3 unrouted)
  Top 0.254: R10.2 3.07,52.12 6.53,52.12 R13.2 6.73,52.12 7.95,52.12 12.42,56.59 20.35,56.59 21.57,55.37 | 21.77,55.17 23.6,53.34 30.1,53.34 32.74,50.7 34.37,50.7 R11.2 | v65.46,35.26 49.61,35.26 48.39,36.47 44.93,36.47 42.9,38.51 42.9,52.93 38.84,57 23.39,57 21.77,55.37
  Bottom 0.254: v65.46,35.26 66.88,33.83 67.29,33.83 67.49,33.63 67.89,33.63 68.1,33.83 69.32,33.83 82.12,21.03 82.32,21.03 82.53,21.23 83.13,21.23 83.34,21.03 83.74,21.03 88.01,16.76 88.01,16.56 90.65,13.92 92.48,13.92 94.92,11.48 95.33,11.48 R12.2
VA  (via drill 0.25)  (2 unrouted)
  Top 0.406: v33.55,15.34 33.3,15.09 33.3,9.91 36.5,6.71 41.43,6.71 43.97,4.17 46.96,4.17 B1.24 | v50.62,35.87 64.16,35.87 67.01,38.71 67.89,38.71 68.83,39.65 68.83,43.51 82.45,57.12 91.92,57.12 94.29,54.76 94.51,54.76 9V.GND | IC2.14 29.77,50.11 35.99,43.89 35.99,42.57 33.35,39.93 33.35,34.04 31.52,32.21 31.52,25.5 30.3,24.28 IC1.6
  Bottom 0.406: v33.55,15.34 33.55,18.39 31.73,20.22 31.73,23.06 | 31.73,23.06 30.71,24.08 30.3,24.08 IC1.6 | v50.62,35.87 48.39,33.63 46.35,33.63 43.31,30.58 43.31,30.18 42.09,28.96 37.21,28.96 36.2,27.94 36.2,26.72 32.54,23.06 31.73,23.06
VC  (7 unrouted)
VD  (4 unrouted)